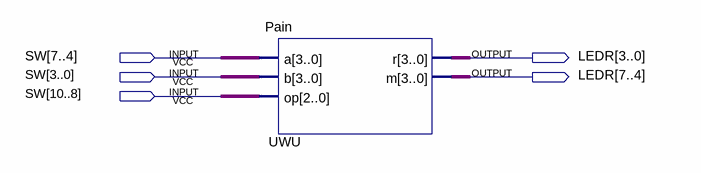
[diagram p0: schematic sheet]
// Quartus schematic PainDemo.bdf as structural Verilog: 1 symbols, 5 pins
module PainDemo (
  input  [10:0] SW,
  output [7:0] LEDR
);

  Pain UWU (.a(SW[7:4]), .b(SW[3:0]), .op(SW[10:8]), .r(LEDR[3:0]), .m(LEDR[7:4]));
endmodule
